# Altium schematic sheet Status_Net_LEDs.SchDoc
size A4; SheetNumber: 8; SheetTotal: 8
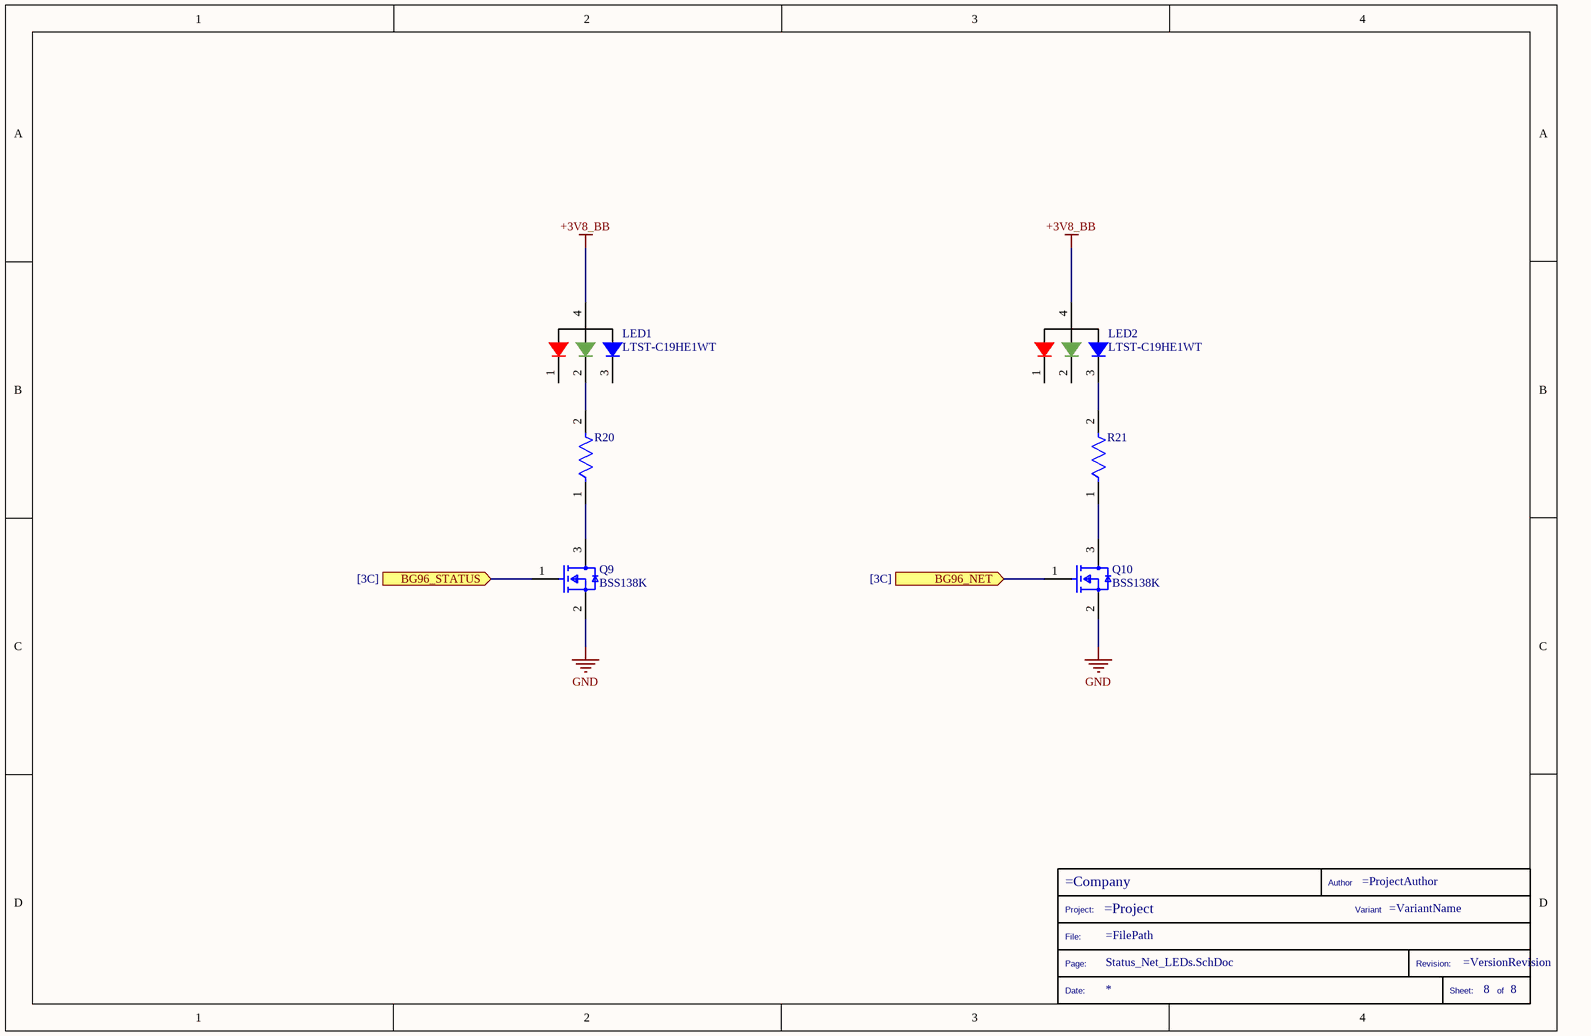
[diagram p0: Status_Net_LEDs.SchDoc]

## Parts
*?  TitleBlock  (value not drawn)  (graphical)
LED1  LTST-C19HE1WT  [LED_LTST-C19HE1WT]
LED2  LTST-C19HE1WT  [LED_LTST-C19HE1WT]
Q9  BSS138K  [FP-318-08-IPC_B]
Q10  BSS138K  [FP-318-08-IPC_B]
R20  0402WGF1001TCE  [FP-CRCW0402-e3-MFG]  (value not drawn)
R21  0402WGF1001TCE  [FP-CRCW0402-e3-MFG]  (value not drawn)

## Ports
BG96_NET (in, see [3C]), BG96_STATUS (in, see [3C])

## Nets
+3V8_BB: LED1.4 LED2.4
GND: Q9.2(S) Q10.2(S)
BG96_NET: Q10.1(G) ; port BG96_NET
BG96_STATUS: Q9.1(G) ; port BG96_STATUS
NetLED1_2: LED1.2 R20.2
NetLED2_3: LED2.3 R21.2
NetQ9_3: Q9.3(D) R20.1
NetQ10_3: Q10.3(D) R21.1

Not connected (* = marked no-connect by the designer): LED1 1 3; LED2 1 2

## Notes on the sheet
- (in symbol TitleBlock) Author; Project:; Variant; File:; Page:; Revision:; Date:; Sheet:; of

## Library data of the parts
LED1 LED2 = LPN00015: Red, Green, Blue _RGB_ 624nm Red, 525nm Green, 470nm Blue LED Indication - Discrete 2.1V Red, 3.35V Green, 3.35V Blue 0606 _1616 Metric_; Supplier 1: Digi-Key; Supplier Part Number 1: 160-2162-1-ND; Lumen Part Number: LPN00015
Q9 Q10 = LPN0007: MOSFET N-CH 50V 220MA SOT-23; Manufacturer 1: ON Semiconductor / Fairchild; Manufacturer Part Number 1: BSS138; Supplier 1: Digi-Key; Supplier Part Number 1: BSS138K-13DICT-ND; Lumen Part Number: LPN0007
R20 R21 = LPN0001: Res Thick Film 0402 1K Ohm 1% 0.063W; Manufacturer 1: Vishay Dale; Manufacturer Part Number 1: CRCW04021K00FKED; Supplier 1: Mouser; Supplier Part Number 1: 303-0402WGF1001TCE; Lumen Part Number: LPN0001